# EAGLE schematic RJ-45 v1.1 Top Routed (EAGLE 9.5.2)
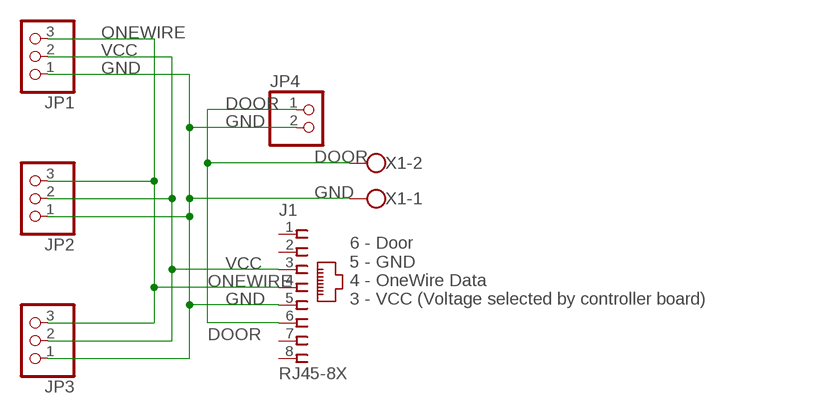
[diagram p0: schematic, sheet 1]

## Parts
J1  RJ45-8X  [RJ45-NO-SHIELD]
JP1  PINHD-1X3  [1X03]
JP2  PINHD-1X3  [1X03]
JP3  PINHD-1X3  [1X03]
JP4  PINHD-1X2  [1X02]
X1  W237-102  [W237-102]

## Nets
DOOR: J1.6 JP4.1 X1.2
GND: J1.5 JP1.1 JP2.1 JP3.1 JP4.2 X1.1
ONEWIRE: J1.4 JP1.3 JP2.3 JP3.3
VCC: J1.3 JP1.2 JP2.2 JP3.2
Unconnected: J1.1 J1.2 J1.7 J1.8

## Notes on the sheet
- 6 - Door
  5 - GND
  4 - OneWire Data
  3 - VCC (Voltage selected by controller board)

## Library data of the parts
J1 = con-tycoelectronics:RJ45: CORCOM Modular RJ Jacks No Shield Source: www.tycoelectronics.com .. ENG_DS_1654001_1099_RJ_L_0507.pdf; MPN: RJ45-8X; OC_FARNELL: unknown; OC_NEWARK: 16R6101
JP1-JP3 = pinhead:PINHD-1X3: PIN HEADER
JP4 = pinhead:PINHD-1X2: PIN HEADER
X1 = con-wago-500:W237-102: WAGO SCREW CLAMP; MPN: 237-102; OC_FARNELL: unknown; OC_NEWARK: 70K9898